# Altium schematic sheet Keyboard.SchDoc: Insane Keyboard
size A4; Author: Parth Thakkar; CompanyName: Insane; DrawnBy: Parth; Engineer: Parth; Organization: Low Self Esteam; DocumentNumber: 1; Revision: v1.0; SheetNumber: 2; SheetTotal: 8
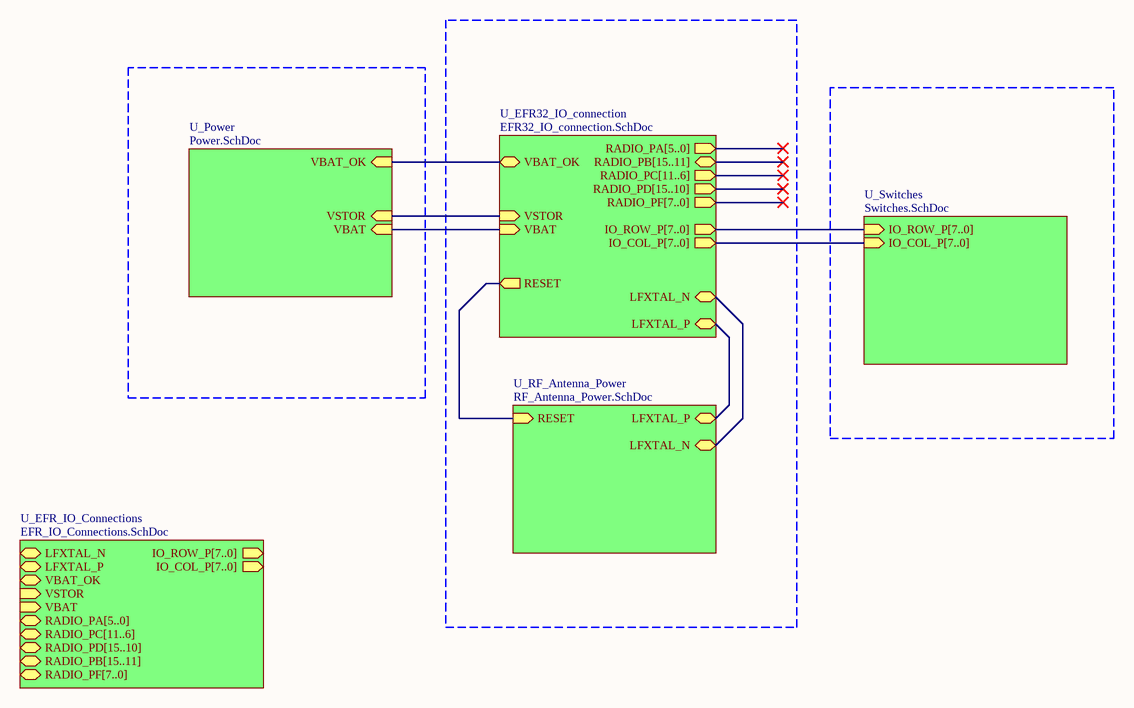
[diagram p0: Keyboard.SchDoc]

## Sub-sheets
U_EFR32_IO_connection = EFR32_IO_connection.SchDoc: RADIO_PA[5..0] (out), RADIO_PC[11..6] (out), RADIO_PD[15..10] (out), RADIO_PF[7..0] (out), RESET (out), IO_ROW_P[7..0] (out), IO_COL_P[7..0] (out), RADIO_PB[15..11] (bidir), LFXTAL_N (bidir), LFXTAL_P (bidir), VBAT_OK (bidir), VSTOR (in), VBAT (in)
U_EFR_IO_Connections = EFR_IO_Connections.SchDoc: IO_ROW_P[7..0] (out), IO_COL_P[7..0] (out), LFXTAL_N (bidir), LFXTAL_P (bidir), VBAT_OK (bidir), VSTOR (in), VBAT (in), RADIO_PA[5..0] (bidir), RADIO_PC[11..6] (bidir), RADIO_PD[15..10] (bidir), RADIO_PB[15..11] (bidir), RADIO_PF[7..0] (bidir)
U_Power = Power.SchDoc: VBAT_OK (in), VSTOR (in), VBAT (in)
U_RF_Antenna_Power = RF_Antenna_Power.SchDoc: RESET (in), LFXTAL_N (bidir), LFXTAL_P (bidir)
U_Switches = Switches.SchDoc: IO_ROW_P[7..0] (in), IO_COL_P[7..0] (in)

## Nets
(unnamed): sheet U_EFR32_IO_connection/RESET, sheet U_RF_Antenna_Power/RESET
(unnamed): sheet U_EFR32_IO_connection/LFXTAL_N, sheet U_RF_Antenna_Power/LFXTAL_N
(unnamed): sheet U_EFR32_IO_connection/LFXTAL_P, sheet U_RF_Antenna_Power/LFXTAL_P
(unnamed): sheet U_EFR32_IO_connection/VBAT_OK, sheet U_Power/VBAT_OK
(unnamed): sheet U_EFR32_IO_connection/VSTOR, sheet U_Power/VSTOR
(unnamed): sheet U_EFR32_IO_connection/VBAT, sheet U_Power/VBAT

## Buses and harness runs
bus sheet U_EFR32_IO_connection/IO_COL_P[7..0] = sheet U_Switches/IO_COL_P[7..0]
bus sheet U_EFR32_IO_connection/IO_ROW_P[7..0] = sheet U_Switches/IO_ROW_P[7..0]